# Altium project e-candle.PrjPcb
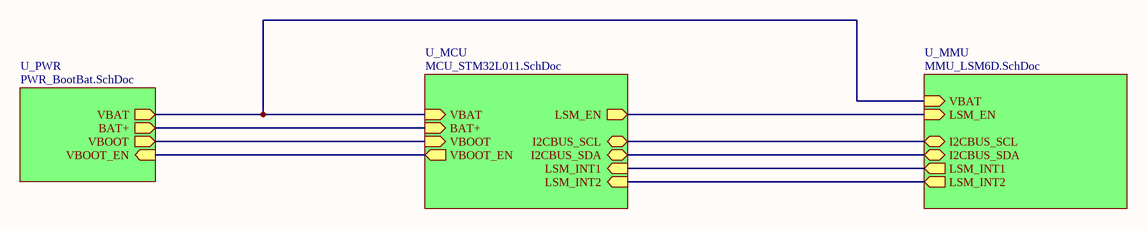
[diagram p0: E-Candle.SchDoc]
4 sheets, 63 parts. Net scope: hierarchical (ports join the sheet entries above them; power ports are global).
Board file: PCB1.PcbDoc
Sheets:
  E-Candle.SchDoc
    U_PWR = PWR_BootBat.SchDoc
    U_MCU = MCU_STM32L011.SchDoc
    U_MMU = MMU_LSM6D.SchDoc

## Sheet E-Candle.SchDoc: E-Candle TestBoard
size A4; DrawnBy: BossFish; Revision: Test/v0.2; SheetNumber: 1; SheetTotal: 4

### Sub-sheets
U_MCU = MCU_STM32L011.SchDoc: I2CBUS_SCL (bidir), VBAT (in), VBOOT_EN (out), VBOOT (in), I2CBUS_SDA (bidir), LSM_INT1 (in), LSM_INT2 (in), LSM_EN (out), BAT+ (in)
U_MMU = MMU_LSM6D.SchDoc: LSM_EN (in), I2CBUS_SCL (bidir), I2CBUS_SDA (bidir), LSM_INT1 (out), LSM_INT2 (out), VBAT (in)
U_PWR = PWR_BootBat.SchDoc: VBOOT_EN (in), VBAT (out), VBOOT (out), BAT+ (out)

### Nets
VBAT: sheet U_PWR/VBAT, sheet U_MCU/VBAT, sheet U_MMU/VBAT
VBOOT: sheet U_PWR/VBOOT, sheet U_MCU/VBOOT
BAT+: sheet U_PWR/BAT+, sheet U_MCU/BAT+
LSM_EN: sheet U_MCU/LSM_EN, sheet U_MMU/LSM_EN
LSM_SI2C_SCL: sheet U_MCU/I2CBUS_SCL, sheet U_MMU/I2CBUS_SCL
LSM_SI2C_SDA: sheet U_MCU/I2CBUS_SDA, sheet U_MMU/I2CBUS_SDA
LSM_SINT1: sheet U_MCU/LSM_INT1, sheet U_MMU/LSM_INT1
LSM_SINT2: sheet U_MCU/LSM_INT2, sheet U_MMU/LSM_INT2
VBOOT_EN: sheet U_PWR/VBOOT_EN, sheet U_MCU/VBOOT_EN

## Sheet PWR_BootBat.SchDoc: PWR_BootBat
size A4; DrawnBy: BossFish; Revision: Test/v0.2; SheetNumber: 2; SheetTotal: 4
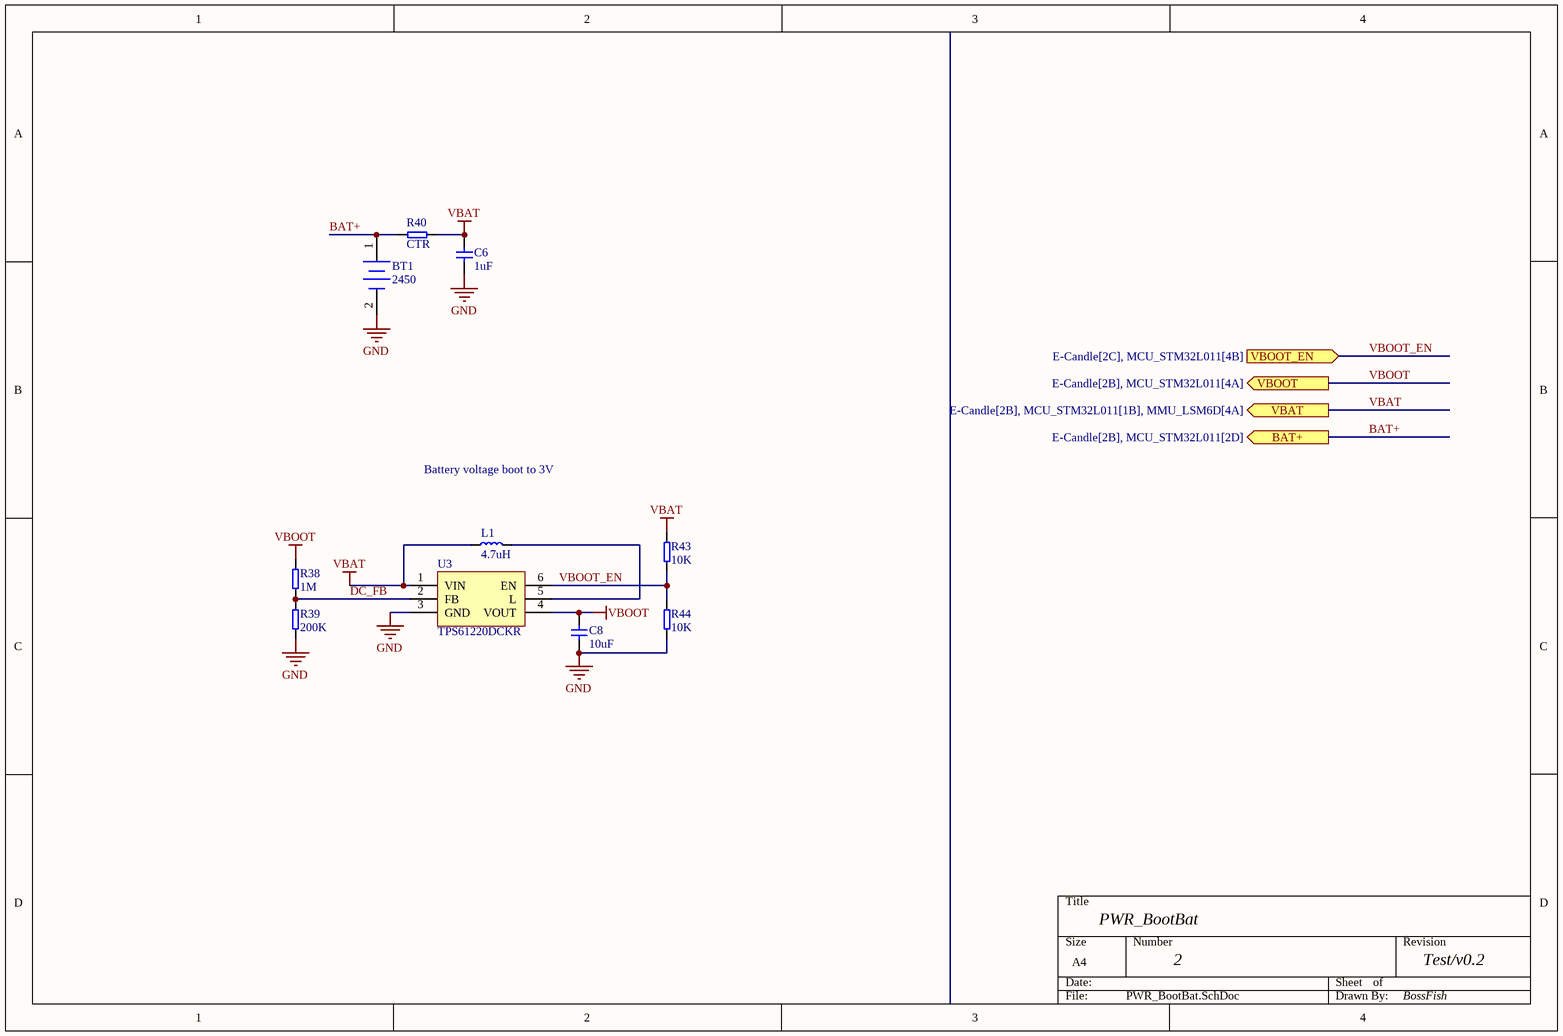
[diagram p1: PWR_BootBat.SchDoc]

### Parts
BT1  2450  [CR2450_CJ]
C6  1uF  [0603-C]
C8  10uF  [0603-C]
L1  4.7uH  [0805-L]
R38  1M  [0603-R]
R39  200K  [0603-R]
R40  CTR  [0603-R]
R43  10K  [0603-R]
R44  10K  [0603-R]
U3  TPS61220DCKR  [SC-70-6]

### Ports
BAT+ (out, see E-Candle[2B], MCU_STM32L011[2D]), VBAT (out, see E-Candle[2B], MCU_STM32L011[1B], MMU_LSM6D[4A]), VBOOT (out, see E-Candle[2B], MCU_STM32L011[4A]), VBOOT_EN (in, see E-Candle[2C], MCU_STM32L011[4B])

### Nets
GND: BT1.2(-) C6.1 C8.1 R39.1 R44.1 U3.3(GND)
VBAT: C6.2 L1.1 R40.1 R43.2 U3.1(VIN) ; port VBAT
VBOOT: C8.2 R38.2 U3.4(VOUT) ; port VBOOT
BAT+: BT1.1(+) R40.2 ; port BAT+
DC_FB: R38.1 R39.2 U3.2(FB)
VBOOT_EN: R43.1 R44.2 U3.6(EN) ; port VBOOT_EN
NetL1_2: L1.2 U3.5(L)

### Notes on the sheet
- Battery voltage boot to 3V

### Library data of the parts
BT1 = Battery: Multicell Battery; Published: 24-Mar-1999; LatestRevisionDate: 17-Jul-2002; LatestRevisionNote: Re-released for DXP Platform.; PackageReference: BAT-2; Publisher: Altium Limited; PackageDescription: Battery; 2 Leads
C6 C8 = Cap
L1 = Inductor
R38-R40 R43 R44 = Res
U3 = TPS61220DCKR: TPS6122x Low Input Voltage, 0.7V Boost Converter With 5.5μA Quiescent Current

## Sheet MCU_STM32L011.SchDoc: MCU_STM32L011
size A4; DrawnBy: BossFish; Revision: Test/v0.2; SheetNumber: 3; SheetTotal: 4
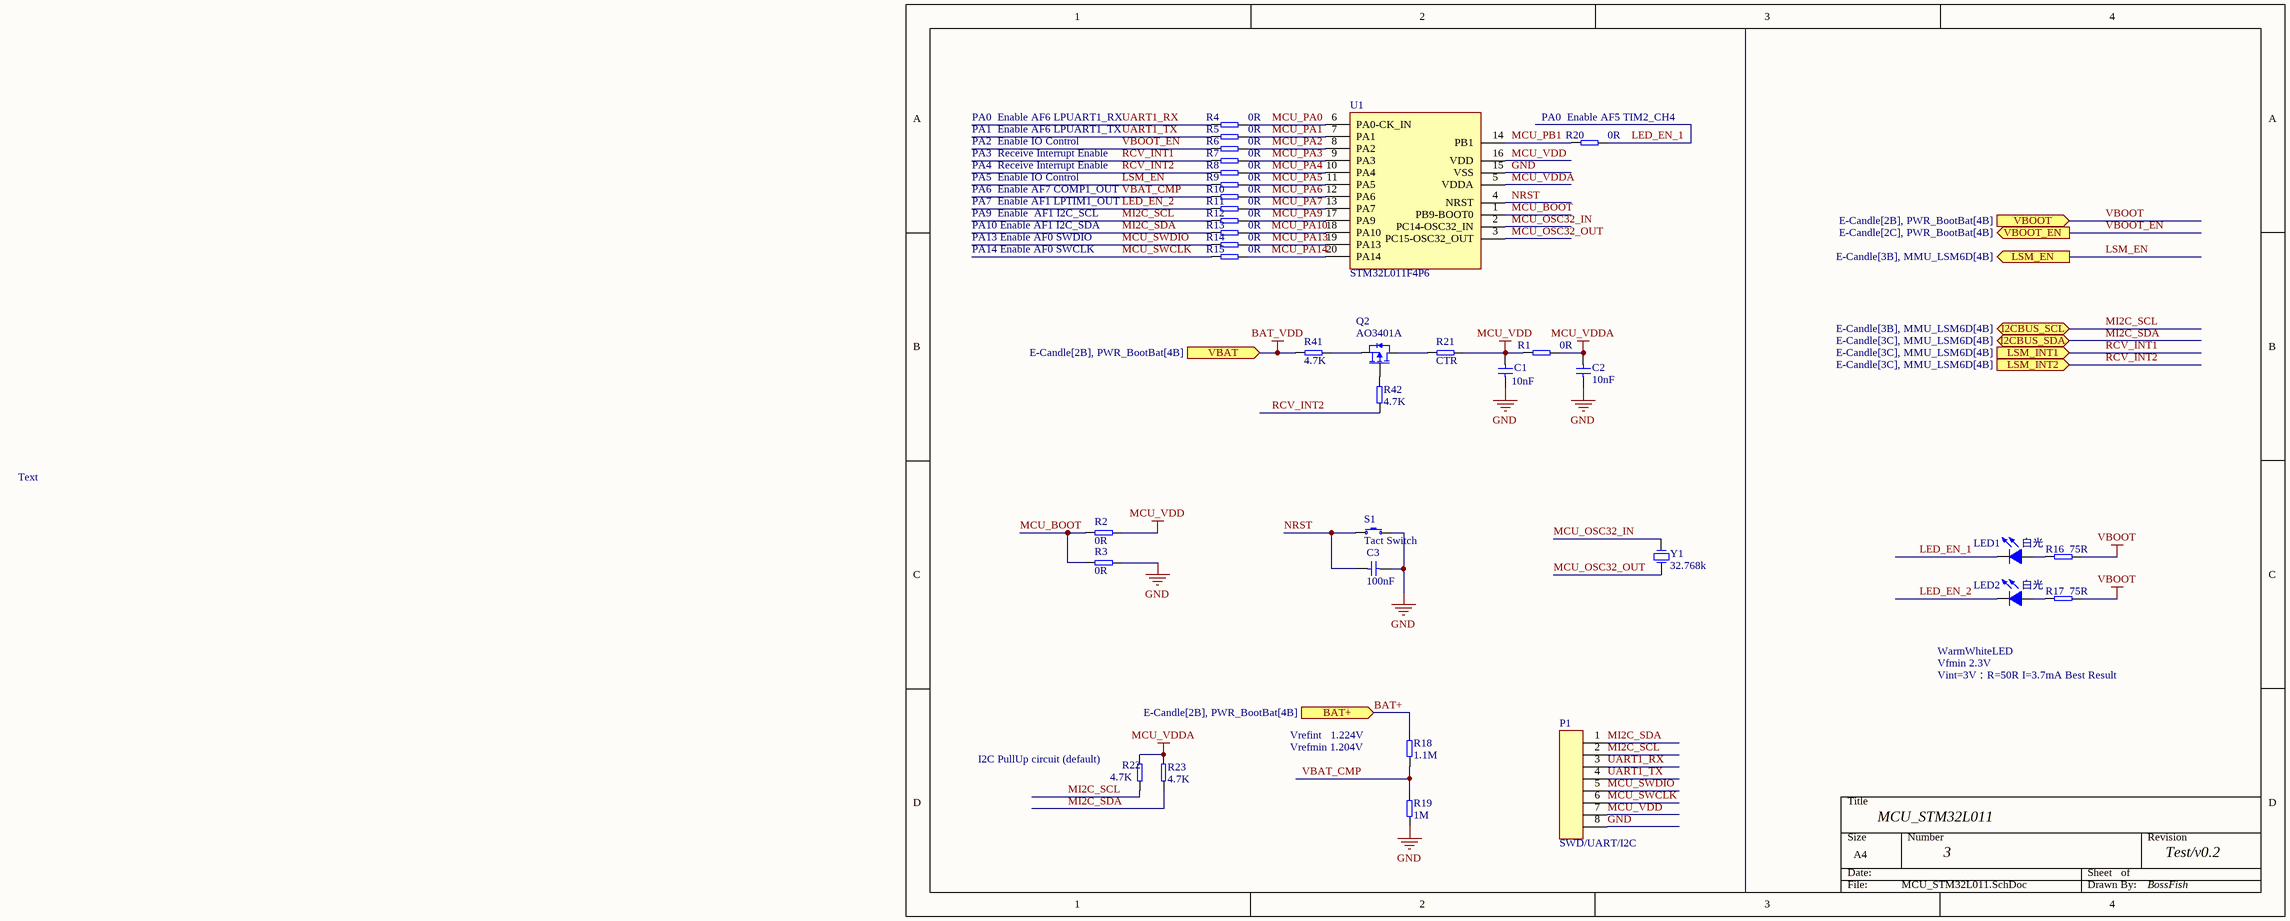
[diagram p2: MCU_STM32L011.SchDoc]

### Parts
C1  10nF  [0603-C]
C2  10nF  [0603-C]
C3  100nF  [0603-C]
LED1  白光  [0805-LED]
LED2  白光  [0805-LED]
P1  SWD/UART/I2C  [2.54mm 1x8P]
Q2  AO3401A  [SOT-23-3]
R1  0R  [0603-R]
R2  0R  [0603-R]
R3  0R  [0603-R]
R4  0R  [0603-R]
R5  0R  [0603-R]
R6  0R  [0603-R]
R7  0R  [0603-R]
R8  0R  [0603-R]
R9  0R  [0603-R]
R10  0R  [0603-R]
R11  0R  [0603-R]
R12  0R  [0603-R]
R13  0R  [0603-R]
R14  0R  [0603-R]
R15  0R  [0603-R]
R16  75R  [0603-R]
R17  75R  [0603-R]
R18  1.1M  [0603-R]
R19  1M  [0603-R]
R20  0R  [0603-R]
R21  CTR  [0603-R]
R22  4.7K  [0603-R]
R23  4.7K  [0603-R]
R41  4.7K  [0603-R]
R42  4.7K  [0603-R]
S1  Tact Switch  [TS-3025]
U1  STM32L011F4P6  [TSSOP-20]
Y1  32.768k  [SMD3215-2P]

### Ports
BAT+ (in, see E-Candle[2B], PWR_BootBat[4B]), I2CBUS_SCL (bidir, see E-Candle[3B], MMU_LSM6D[4B]), I2CBUS_SDA (bidir, see E-Candle[3C], MMU_LSM6D[4B]), LSM_EN (out, see E-Candle[3B], MMU_LSM6D[4B]), LSM_INT1 (in, see E-Candle[3C], MMU_LSM6D[4B]), LSM_INT2 (in, see E-Candle[3C], MMU_LSM6D[4B]), VBAT (in, see E-Candle[2B], PWR_BootBat[4B]), VBOOT (in, see E-Candle[2B], PWR_BootBat[4B]), VBOOT_EN (out, see E-Candle[2C], PWR_BootBat[4B])

### Nets
BAT_VDD: R41.2 ; port VBAT  [project net VBAT]
GND: C1.1 C2.1 C3.2 P1.8 R3.1 R19.1 S1.2 U1.15(VSS)
MCU_VDD: C1.2 P1.7 R1.2 R2.1 R21.1 U1.16(VDD)
MCU_VDDA: C2.2 R1.1 R22.2 R23.2 U1.5(VDDA)
VBOOT: R16.2 R17.2 ; port VBOOT
BAT+: R18.2 ; port BAT+
LED_EN_1: LED1.1 R20.1
LED_EN_2: LED2.1 R11.2
LSM_EN: R9.2 ; port LSM_EN
MCU_BOOT: R2.2 R3.2 U1.1(PB9-BOOT0)
MCU_OSC32_IN: U1.2(PC14-OSC32_IN) Y1.2
MCU_OSC32_OUT: U1.3(PC15-OSC32_OUT) Y1.1
MCU_PA0: R4.1 U1.6(PA0-CK_IN)
MCU_PA1: R5.1 U1.7(PA1)
MCU_PA2: R6.1 U1.8(PA2)
MCU_PA3: R7.1 U1.9(PA3)
MCU_PA4: R8.1 U1.10(PA4)
MCU_PA5: R9.1 U1.11(PA5)
MCU_PA6: R10.1 U1.12(PA6)
MCU_PA7: R11.1 U1.13(PA7)
MCU_PA9: R12.1 U1.17(PA9)
MCU_PA10: R13.1 U1.18(PA10)
MCU_PA13: R14.1 U1.19(PA13)
MCU_PA14: R15.1 U1.20(PA14)
MCU_PB1: R20.2 U1.14(PB1)
MCU_SWCLK: P1.6 R15.2
MCU_SWDIO: P1.5 R14.2
MI2C_SCL: P1.2 R12.2 R22.1 ; port I2CBUS_SCL  [project net LSM_SI2C_SCL]
MI2C_SDA: P1.1 R13.2 R23.1 ; port I2CBUS_SDA  [project net LSM_SI2C_SDA]
NRST: C3.1 S1.1 U1.4(NRST)
RCV_INT1: R7.2 ; port LSM_INT1  [project net LSM_SINT1]
RCV_INT2: R8.2 R42.2 ; port LSM_INT2  [project net LSM_SINT2]
UART1_RX: P1.3 R4.2
UART1_TX: P1.4 R5.2
VBAT_CMP: R10.2 R18.1 R19.2
VBOOT_EN: R6.2 ; port VBOOT_EN
NetLED1_2: LED1.2 R16.1
NetLED2_2: LED2.2 R17.1
NetQ2_1: Q2.1(D) R21.2
NetQ2_2: Q2.2(G) R42.1
NetQ2_3: Q2.3(S) R41.1

### Notes on the sheet
- PA0  Enable AF6 LPUART1_RX
- PA1  Enable AF6 LPUART1_TX
- PA2  Enable IO Control
- PA3  Receive Interrupt Enable
- (near R20) PA0  Enable AF5 TIM2_CH4
- PA9  Enable  AF1 I2C_SCL
- PA6  Enable AF7 COMP1_OUT
- PA7  Enable AF1 LPTIM1_OUT
- PA5  Enable IO Control
- PA4  Receive Interrupt Enable
- PA10 Enable AF1 I2C_SDA
- PA13 Enable AF0 SWDIO
- PA14 Enable AF0 SWCLK
- Text
- WarmWhiteLED
- Vfmin 2.3V
- Vint=3V：R=50R I=3.7mA Best Result
- (near R18) Vrefint   1.224V
- Vrefmin 1.204V
- (near R22) I2C PullUp circuit (default)

### Library data of the parts
C1-C3 = Cap
LED1 LED2 = LED
P1 = Header 1x8P
Q2 = MOSFET-P
R1-R23 R41 R42 = Res
U1 = STM32L011F4P6: Ultra-low-power 32-bit MCU Arm®-based / Cortex®-M0+, 16KB Flash, 2KB SRAM, 512B EEPROM, ADC/TSSOP-20
Y1 = XTAL

## Sheet MMU_LSM6D.SchDoc: MMU_LSD6D
size A4; DrawnBy: BossFish; Revision: Test/v0.2; SheetNumber: 4; SheetTotal: 4
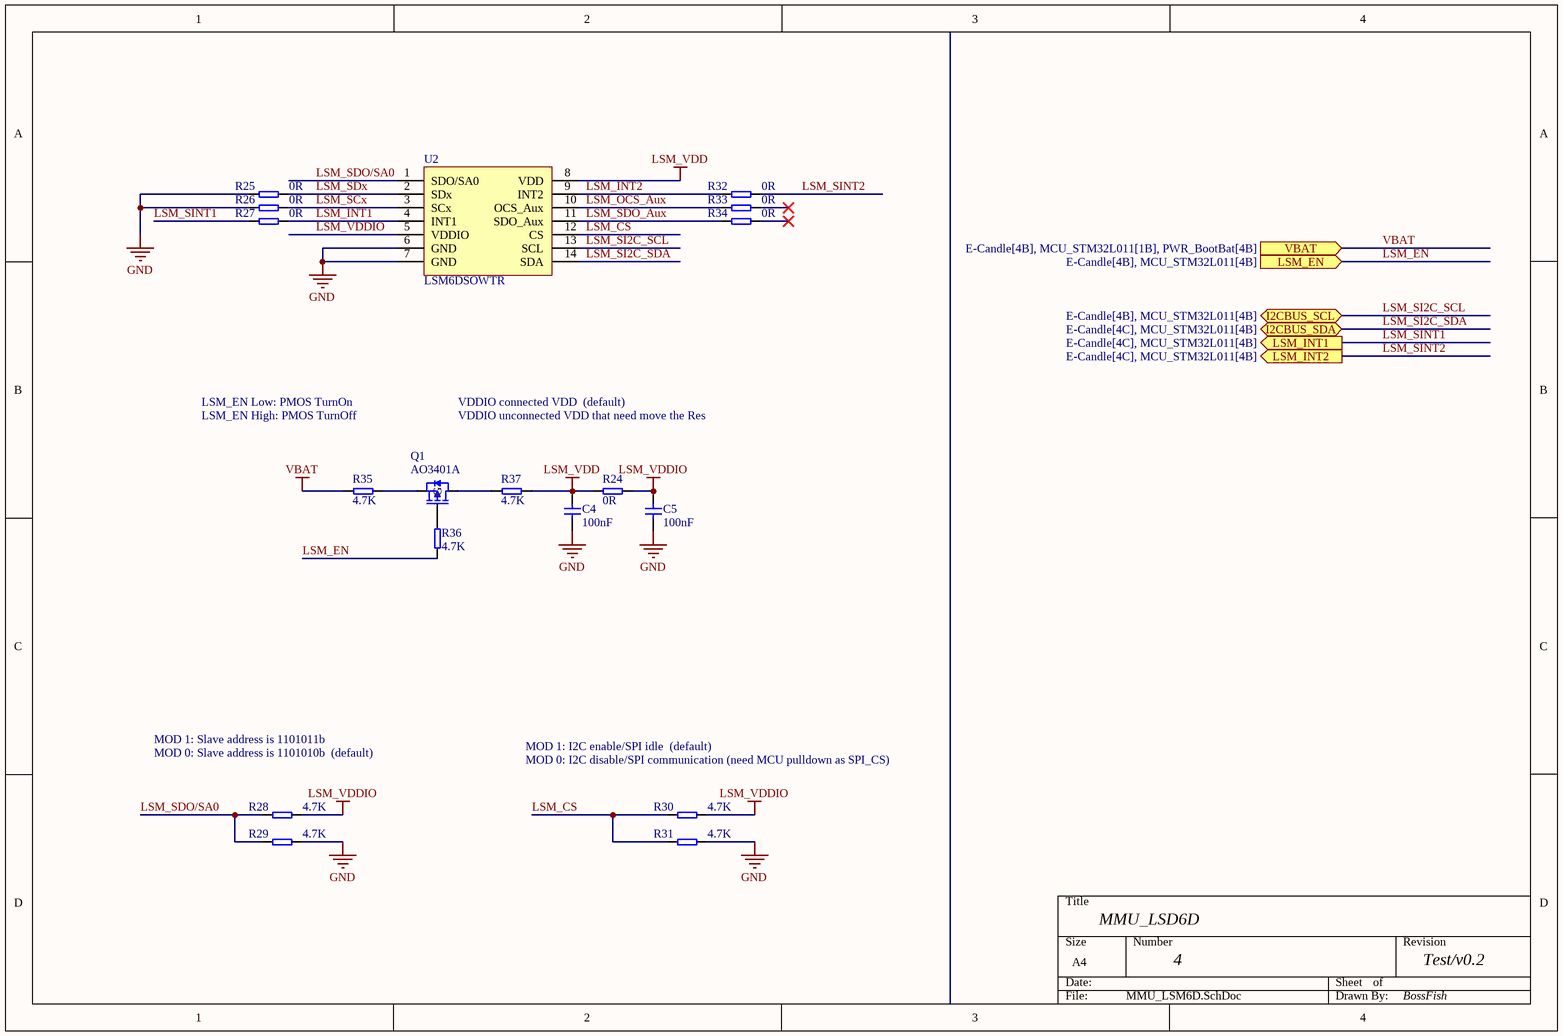
[diagram p3: MMU_LSM6D.SchDoc]

### Parts
C4  100nF  [0603-C]
C5  100nF  [0603-C]
Q1  AO3401A  [SOT-23-3]
R24  0R  [0603-R]
R25  0R  [0603-R]
R26  0R  [0603-R]
R27  0R  [0603-R]
R28  4.7K  [0603-R]
R29  4.7K  [0603-R]
R30  4.7K  [0603-R]
R31  4.7K  [0603-R]
R32  0R  [0603-R]
R33  0R  [0603-R]
R34  0R  [0603-R]
R35  4.7K  [0603-R]
R36  4.7K  [0603-R]
R37  4.7K  [0603-R]
U2  LSM6DSOWTR  [LGA-14L(2.5x3.0)]

### Ports
I2CBUS_SCL (bidir, see E-Candle[4B], MCU_STM32L011[4B]), I2CBUS_SDA (bidir, see E-Candle[4C], MCU_STM32L011[4B]), LSM_EN (in, see E-Candle[4B], MCU_STM32L011[4B]), LSM_INT1 (out, see E-Candle[4C], MCU_STM32L011[4B]), LSM_INT2 (out, see E-Candle[4C], MCU_STM32L011[4B]), VBAT (in, see E-Candle[4B], MCU_STM32L011[1B], PWR_BootBat[4B])

### Nets
GND: C4.1 C5.1 R25.1 R26.1 R29.2 R31.2 U2.6(GND) U2.7(GND)
LSM_VDD: C4.2 R24.1 R37.1 U2.8(VDD)
LSM_VDDIO: C5.2 R24.2 R28.2 R30.2 U2.5(VDDIO)
VBAT: R35.2 ; port VBAT
LSM_CS: R30.1 R31.1 U2.12(CS)
LSM_EN: R36.2 ; port LSM_EN
LSM_INT1: R27.2 U2.4(INT1)
LSM_INT2: R32.1 U2.9(INT2)
LSM_OCS_Aux: R33.1 U2.10(OCS_Aux)
LSM_SCx: R26.2 U2.3(SCx)
LSM_SDO/SA0: R28.1 R29.1 U2.1(SDO/SA0)
LSM_SDO_Aux: R34.1 U2.11(SDO_Aux)
LSM_SDx: R25.2 U2.2(SDx)
LSM_SI2C_SCL: U2.13(SCL) ; port I2CBUS_SCL
LSM_SI2C_SDA: U2.14(SDA) ; port I2CBUS_SDA
LSM_SINT1: R27.1 ; port LSM_INT1
LSM_SINT2: R32.2 ; port LSM_INT2
NetQ1_1: Q1.1(D) R37.2
NetQ1_2: Q1.2(G) R36.1
NetQ1_3: Q1.3(S) R35.1

Not connected (* = marked no-connect by the designer): R33 2*; R34 2*

### Notes on the sheet
- LSM_EN Low: PMOS TurnOn
- LSM_EN High: PMOS TurnOff
- VDDIO connected VDD  (default)
- VDDIO unconnected VDD that need move the Res
- MOD 1: Slave address is 1101011b
- MOD 0: Slave address is 1101010b  (default)
- MOD 1: I2C enable/SPI idle  (default)
- MOD 0: I2C disable/SPI communication (need MCU pulldown as SPI_CS)

### Library data of the parts
C4 C5 = Cap
Q1 = MOSFET-P
R24-R37 = Res
U2 = LSM6DSOWTR: 6-axis IMU (inertial measurement unit): / always-on 3‑axis accelerometer and 3‑axis gyroscop

## Nets that join several sheets
GND: PWR_BootBat (6 pins), MCU_STM32L011 (8 pins), MMU_LSM6D (8 pins)
VBAT: PWR_BootBat (5 pins), MCU_STM32L011 (R41.2), MMU_LSM6D (R35.2)
VBOOT: PWR_BootBat (C8.2 R38.2 U3.4), MCU_STM32L011 (R16.2 R17.2)
BAT+: PWR_BootBat (BT1.1 R40.2), MCU_STM32L011 (R18.2)
LSM_EN: MCU_STM32L011 (R9.2), MMU_LSM6D (R36.2)
LSM_SI2C_SCL: MCU_STM32L011 (P1.2 R12.2 R22.1), MMU_LSM6D (U2.13)
LSM_SI2C_SDA: MCU_STM32L011 (P1.1 R13.2 R23.1), MMU_LSM6D (U2.14)
LSM_SINT1: MCU_STM32L011 (R7.2), MMU_LSM6D (R27.1)
LSM_SINT2: MCU_STM32L011 (R8.2 R42.2), MMU_LSM6D (R32.2)
VBOOT_EN: PWR_BootBat (R43.1 R44.2 U3.6), MCU_STM32L011 (R6.2)